# EAGLE schematic emonPi2C_V1.2 (EAGLE 7.0.0)
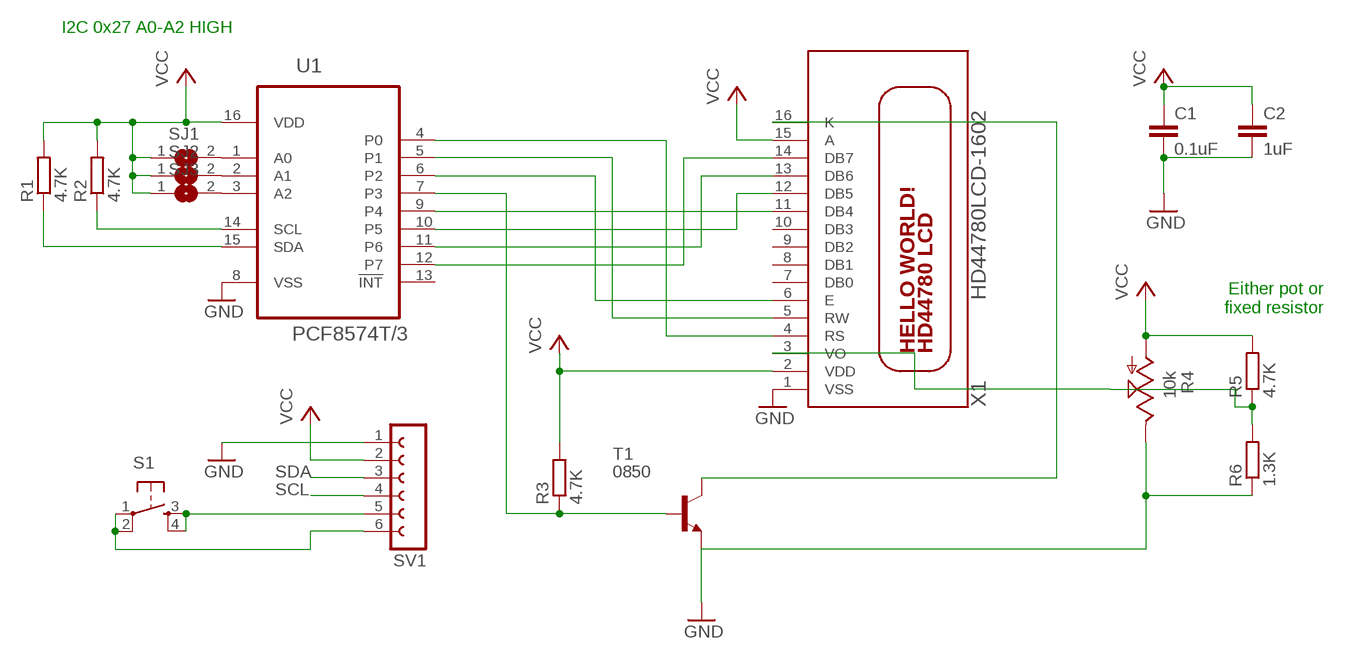
[diagram p0: schematic, sheet 1]

## Parts
C1  0.1uF  C-EUC0603  [C0603]
C2  1uF  C-EUC0603  [C0603]
R1  4.7K  R-EU_R0603  [R0603]
R2  4.7K  R-EU_R0603  [R0603]
R3  4.7K  R-EU_R0603  [R0603]
R4  10k  TRIM_US-B25P  [B25P]
R5  4.7K  R-EU_R0603  [R0603]
R6  1.3K  R-EU_R0603  [R0603]
S1  TAC_SWITCHPTH  [TACTILE-PTH]
SJ1  SOLDERJUMPERCLOSED  [SOLDERJUMPER_CLOSEDWIRE]
SJ2  SOLDERJUMPERCLOSED  [SOLDERJUMPER_CLOSEDWIRE]
SJ3  SOLDERJUMPERCLOSED  [SOLDERJUMPER_CLOSEDWIRE]
SV1  FE06-1  [FE06]
T1  0850  BCX70SMD  [SOT23]
U1  PCF8574T/3  [SOIC127P1032X265-16N]
X1  HD44780LCD-1602  [LCD1602]

## Nets
5V [Power]: C1.1 C2.1 R1.2 R2.2 R3.2 R4.A R5.2 SJ1.1 SJ2.1 SJ3.1 SV1.2 U1.16(VDD) X1.2(VDD) X1.15(A) ; supply symbol labelled VCC
CS: U1.6(P2) X1.6(E)
DB4: U1.9(P4) X1.11(DB4)
DB5: U1.10(P5) X1.12(DB5)
DB6: U1.11(P6) X1.13(DB6)
DB7: U1.12(P7) X1.14(DB7)
GND: C1.2 C2.2 R4.E R6.1 SV1.1 T1.2(E) U1.8(VSS) X1.1(VSS)
K: T1.3(C) X1.16(K)
N$3: SJ3.2 U1.3(A2)
N$4: SJ2.2 U1.2(A1)
N$5: S1.3 S1.4 SV1.5
N$6: S1.1 S1.2 SV1.6
N$7: SJ1.2 U1.1(A0)
N$10: R4.S R5.1 R6.2 X1.3(VO)
P3: R3.1 T1.1(B) U1.7(P3)
RS: U1.4(P0) X1.4(RS)
RW: U1.5(P1) X1.5(RW)
SCL: R2.1 SV1.4 U1.14(SCL)
SDA: R1.1 SV1.3 U1.15(SDA)
Unconnected: U1.13(!INT) X1.7(DB0) X1.8(DB1) X1.9(DB2) X1.10(DB3)

## Notes on the sheet
- I2C 0x27 A0-A2 HIGH
- Either pot or
  fixed resistor

## Library data of the parts
C1 C2 = resistor:C-EU: CAPACITOR, European symbol
R1-R3 R5 R6 = rcl:R-EU_: RESISTOR, European symbol
R4 = pot:TRIM_US-: POTENTIOMETER
S1 = SparkFun-Electromechanical:TAC_SWITCH: Momentary Switch Button commonly used for reset or general input. Spark Fun Electronics SKU : COM-00097 SMT- SWCH-08247
SJ1-SJ3 = microbuilder:SOLDERJUMPER: SMD Solder JUMPER Solder the two pads together to create a connection, or remove the solder to break it. REFLOW - Use this footprint for solder paste and reflow ovens. WAVE - Use this footprint for hand-soldering (larger pads). CLOSED - Has a trace between the two pads to ensure it is closed by default. The trace needs to be cut to disable the jumper, and can be closed again by creating a solder bridge between the two pads.
SV1 = con-lsta:FE06-1: FEMALE HEADER; OC_FARNELL: unknown; OC_NEWARK: unknown
T1 = transistor:BCX70SMD: NPN TRANSISTOR
U1 = PCF8574T:PCF8574T/3: I/O EXPANDER, 8BIT REMOTE, SO-16; MPN: PCF8574T/3; OC_FARNELL: 1506644; OC_NEWARK: Unknown; PACKAGE: SO-16; SUPPLIER: NXP
X1 = adafruit:HD44780LCD: HD44780 LCD Standard character type LCDs, available in sizes from 8x1 to 40x4!

## Net classes
0 default: width 0.254 mm, drill 0.5 mm, clearance 0.254 mm
1 Power: width 0.61 mm, drill 0.5 mm, clearance 0.406 mm